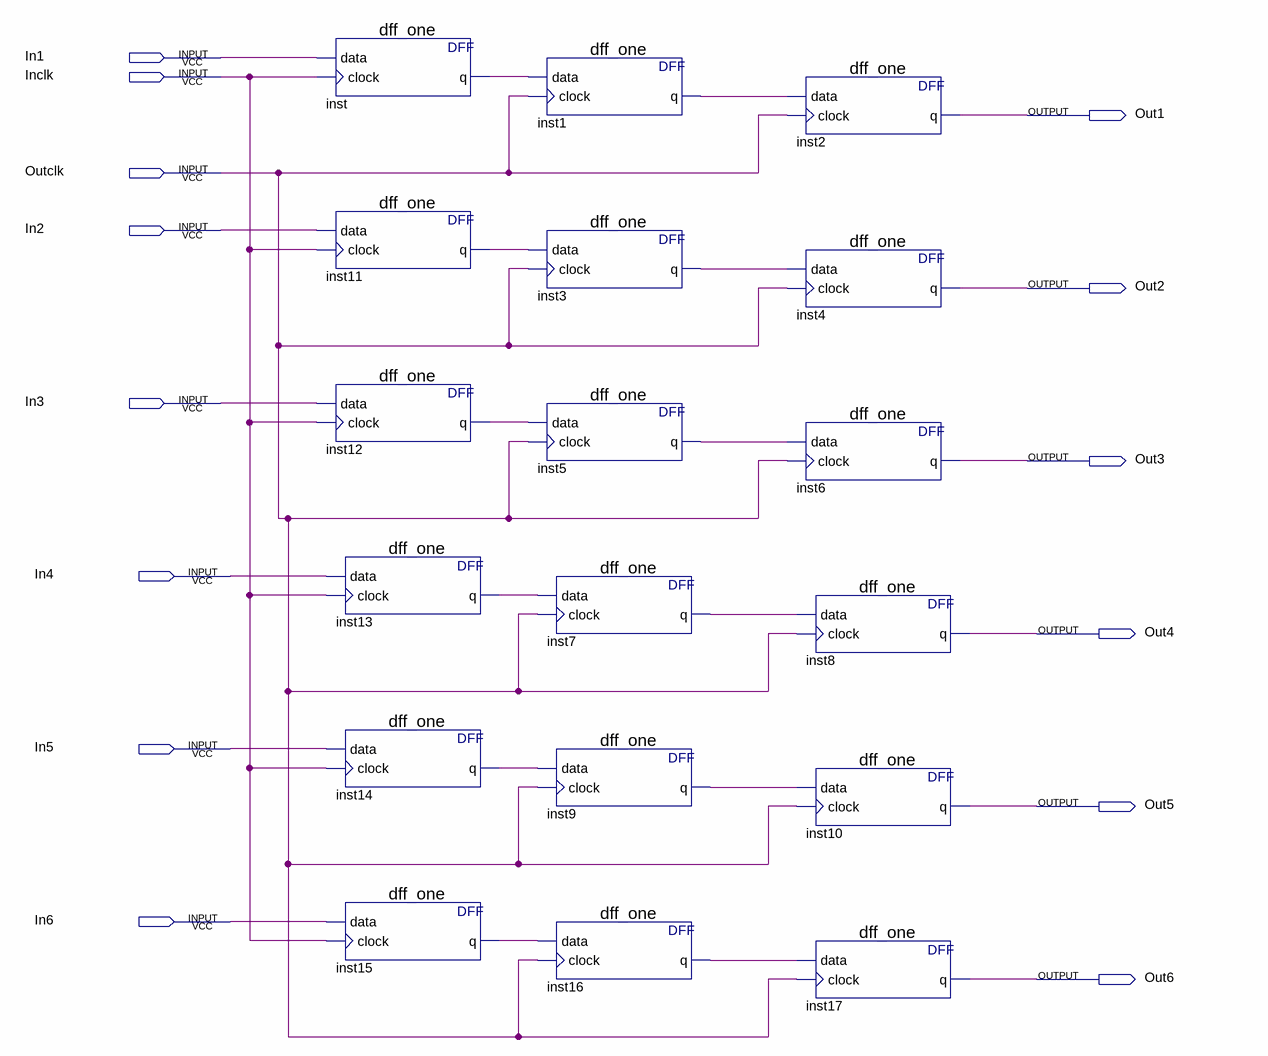
[diagram p0: schematic sheet]
// Quartus schematic synch_lines.bdf as structural Verilog: 18 symbols, 14 pins
module synch_lines (
  input  In1,
  input  Inclk,
  input  Outclk,
  input  In2,
  input  In3,
  input  In4,
  input  In5,
  input  In6,
  output Out1,
  output Out2,
  output Out3,
  output Out4,
  output Out5,
  output Out6
);

  wire inst1_q, inst3_q, inst5_q, inst7_q, inst9_q, inst11_q, inst12_q, inst13_q, inst14_q, inst15_q,
       inst16_q, inst_q;

  dff_one inst (.data(In1), .clock(Inclk), .q(inst_q));
  dff_one inst11 (.data(In2), .clock(Inclk), .q(inst11_q));
  dff_one inst12 (.data(In3), .clock(Inclk), .q(inst12_q));
  dff_one inst13 (.data(In4), .clock(Inclk), .q(inst13_q));
  dff_one inst14 (.data(In5), .clock(Inclk), .q(inst14_q));
  dff_one inst15 (.data(In6), .clock(Inclk), .q(inst15_q));
  dff_one inst1 (.data(inst_q), .clock(Outclk), .q(inst1_q));
  dff_one inst3 (.data(inst11_q), .clock(Outclk), .q(inst3_q));
  dff_one inst5 (.data(inst12_q), .clock(Outclk), .q(inst5_q));
  dff_one inst7 (.data(inst13_q), .clock(Outclk), .q(inst7_q));
  dff_one inst9 (.data(inst14_q), .clock(Outclk), .q(inst9_q));
  dff_one inst16 (.data(inst15_q), .clock(Outclk), .q(inst16_q));
  dff_one inst2 (.data(inst1_q), .clock(Outclk), .q(Out1));
  dff_one inst4 (.data(inst3_q), .clock(Outclk), .q(Out2));
  dff_one inst6 (.data(inst5_q), .clock(Outclk), .q(Out3));
  dff_one inst8 (.data(inst7_q), .clock(Outclk), .q(Out4));
  dff_one inst10 (.data(inst9_q), .clock(Outclk), .q(Out5));
  dff_one inst17 (.data(inst16_q), .clock(Outclk), .q(Out6));
endmodule
